# EAGLE schematic 3x3_Games (EAGLE 6.5.0)
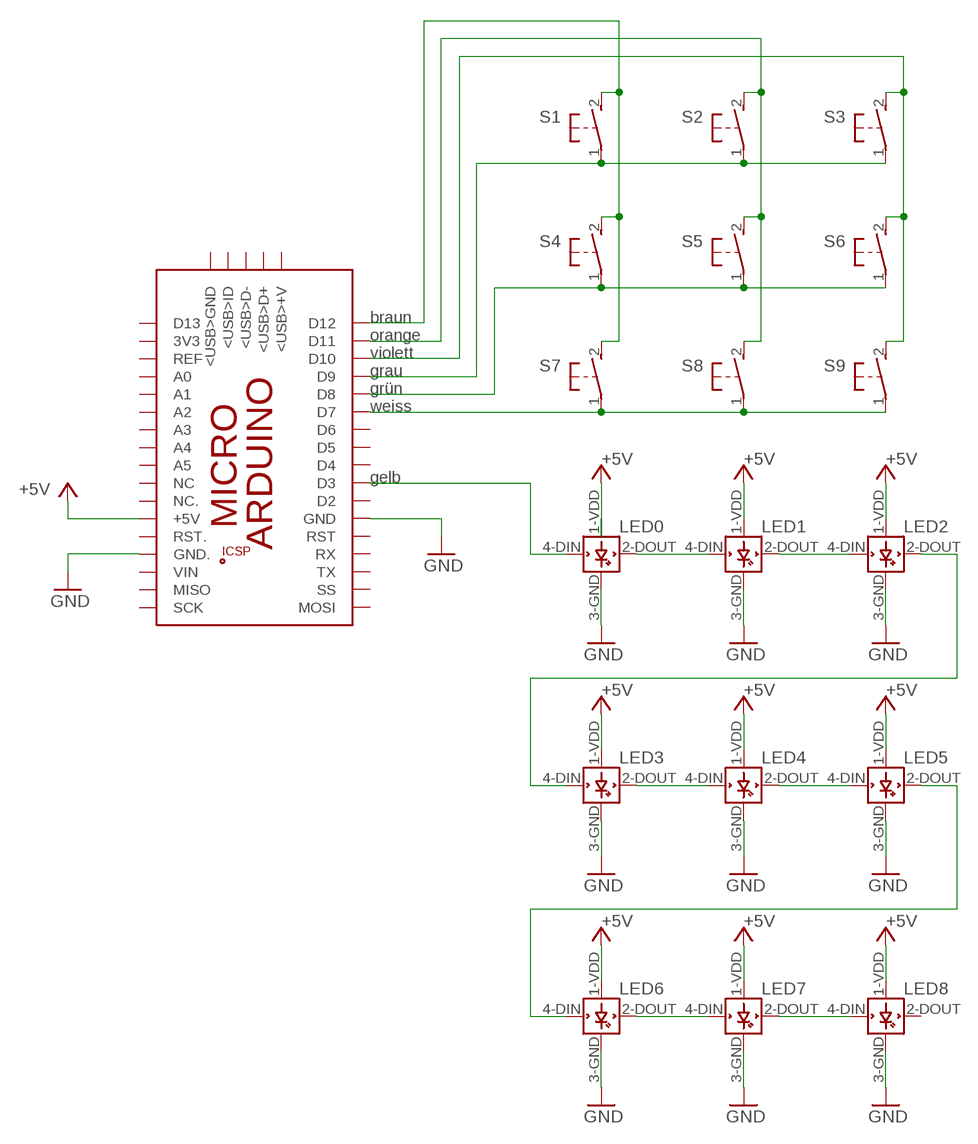
[diagram p0: schematic, sheet 1]

## Parts
LED0  WS2812B  [WS2812B]
LED1  WS2812B  [WS2812B]
LED2  WS2812B  [WS2812B]
LED3  WS2812B  [WS2812B]
LED4  WS2812B  [WS2812B]
LED5  WS2812B  [WS2812B]
LED6  WS2812B  [WS2812B]
LED7  WS2812B  [WS2812B]
LED8  WS2812B  [WS2812B]
PCB1  ARDUINO_MICRO_EXT  (no package)
S1  31-XX  [B3F-31XX]
S2  31-XX  [B3F-31XX]
S3  31-XX  [B3F-31XX]
S4  31-XX  [B3F-31XX]
S5  31-XX  [B3F-31XX]
S6  31-XX  [B3F-31XX]
S7  31-XX  [B3F-31XX]
S8  31-XX  [B3F-31XX]
S9  31-XX  [B3F-31XX]

## Nets
+5V: LED0.1-VDD(VDD) LED1.1-VDD(VDD) LED2.1-VDD(VDD) LED3.1-VDD(VDD) LED4.1-VDD(VDD) LED5.1-VDD(VDD) LED6.1-VDD(VDD) LED7.1-VDD(VDD) LED8.1-VDD(VDD) PCB1.+5V
GND: LED0.3-GND(GND) LED1.3-GND(GND) LED2.3-GND(GND) LED3.3-GND(GND) LED4.3-GND(GND) LED5.3-GND(GND) LED6.3-GND(GND) LED7.3-GND(GND) LED8.3-GND(GND) PCB1.GND PCB1.GND.
N$1: LED0.2-DOUT(DOUT) LED1.4-DIN(DIN)
N$2: LED1.2-DOUT(DOUT) LED2.4-DIN(DIN)
N$3: LED2.2-DOUT(DOUT) LED3.4-DIN(DIN)
N$4: LED3.2-DOUT(DOUT) LED4.4-DIN(DIN)
N$5: LED4.2-DOUT(DOUT) LED5.4-DIN(DIN)
N$6: LED5.2-DOUT(DOUT) LED6.4-DIN(DIN)
N$7: LED6.2-DOUT(DOUT) LED7.4-DIN(DIN)
N$8: LED0.4-DIN(DIN) PCB1.D3
N$9: PCB1.D9 S1.1(P) S2.1(P) S3.1(P)
N$10: PCB1.D8 S4.1(P) S5.1(P) S6.1(P)
N$11: PCB1.D7 S7.1(P) S8.1(P) S9.1(P)
N$15: PCB1.D12 S1.2(S) S4.2(S) S7.2(S)
N$16: PCB1.D11 S2.2(S) S5.2(S) S8.2(S)
N$18: PCB1.D10 S3.2(S) S6.2(S) S9.2(S)
N$19: LED7.2-DOUT(DOUT) LED8.4-DIN(DIN)
Unconnected: LED8.2-DOUT(DOUT) PCB1.3V3 PCB1.5V PCB1.<USB>+V PCB1.<USB>D+ PCB1.<USB>D- PCB1.<USB>GND PCB1.<USB>ID PCB1.A0 PCB1.A1 PCB1.A2 PCB1.A3 PCB1.A4 PCB1.A5 PCB1.D2 PCB1.D4 PCB1.D5 PCB1.D6 PCB1.D13 PCB1.GND_ PCB1.MISO PCB1.MISO. PCB1.MOSI PCB1.MOSI. PCB1.NC PCB1.NC. PCB1.REF PCB1.RESET.. PCB1.RST PCB1.RST. PCB1.RX PCB1.SCK PCB1.SCK. PCB1.SS PCB1.TX PCB1.VIN

## Notes on the sheet
- braun
- orange
- violett
- grau
- grün
- weiss
- gelb

## Library data of the parts
LED0 LED1-LED8 = adafruit:WS2812B
PCB1 = E14_Arduino:ARDUINO_MICRO_EXT: Device for representing an Arduino Micro board in an EAGLE design without the PCB footprint. Created by Dave Young for Element14. More EAGLE documentation at: http://www.element14.com/community/community/knode/cadsoft_eagle
S1-S9 = switch-omron:31-XX: OMRON SWITCH; MPN: B3F-3100; OC_FARNELL: 959704; OC_NEWARK: 36M3582